# Altium project gps-barometer.PrjPcb
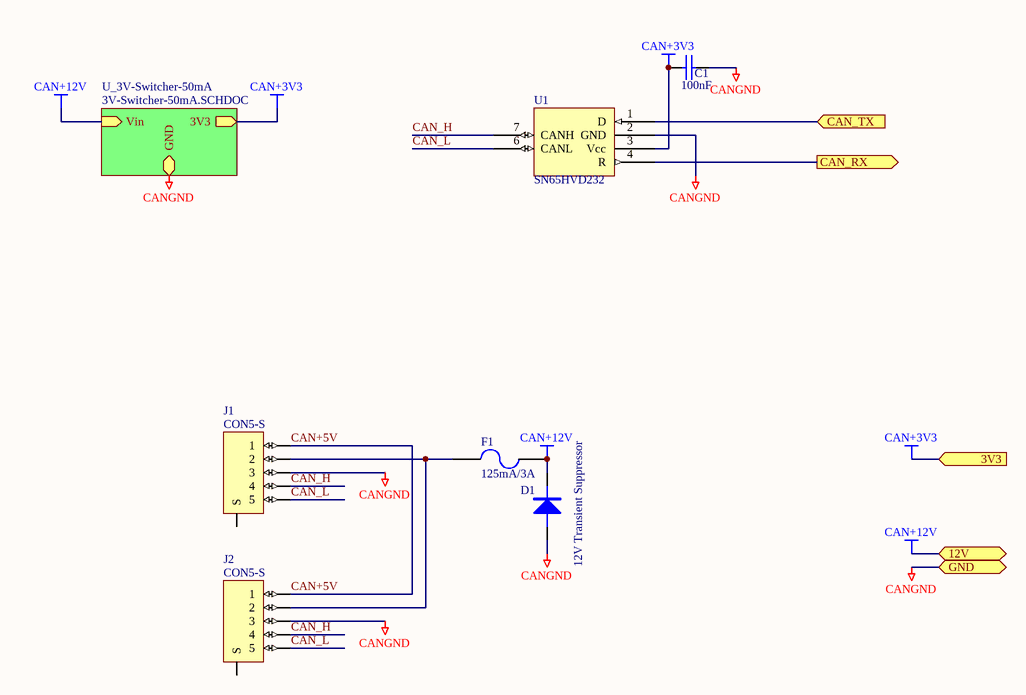
[diagram p0: 3V3-CAN-UNISOLATED.SchDoc]
4 sheets, 48 parts. Net scope: hierarchical (ports join the sheet entries above them; power ports are global).
Board files: CAN_faceplate.PcbDoc, CANFaceplate.PcbDoc, GPSBarometer.PcbDoc
Sheets:
  3V3-CAN-UNISOLATED.SchDoc
  TopLevel.SchDoc
    LPC = LPC_Rep.SchDoc
    GPSBarometer = GPSBarometer.SchDoc

## Sheet 3V3-CAN-UNISOLATED.SchDoc
size A4; Organization: UNSW Solar Racing Team; Address3: UNSW; Address4: Sydney NSW 2052; Address2: Electrical Engineering; Address1: Rm 109

### Parts
C1  100nF  [0603]
D1  12V Transient Suppressor  [SMA]
F1  125mA/3A  [LITTELFUSE-154]
J1  CON5-S  [TRIAD5F]
J2  CON5-S  [TRIAD5F]
U1  SN65HVD232  [SO8]

### Sub-sheets
U_3V-Switcher-50mA = 3V-Switcher-50mA.SCHDOC (file not in this document): GND, 3V3, Vin

### Ports
3V3, 12V, CAN_RX (out), CAN_TX (in), GND

### Nets
CAN+3V3: C1.2 U1.3(Vcc) ; port 3V3, sheet U_3V-Switcher-50mA/3V3
CAN+12V: D1.K F1.2 ; port 12V, sheet U_3V-Switcher-50mA/Vin
CANGND: C1.1 D1.A J1.3 J2.3 U1.2(GND) ; port GND, sheet U_3V-Switcher-50mA/GND
CAN+5V: J1.1 J2.1
CAN_H: J1.4 J2.4 U1.7(CANH)
CAN_L: J1.5 J2.5 U1.6(CANL)
NetF1_1: F1.1 J1.2 J2.2
NetU1_1: U1.1(D) ; port CAN_TX
NetU1_4: U1.4(R) ; port CAN_RX

Not connected (* = marked no-connect by the designer): J1 0(S); J2 0(S)

### Notes on the sheet
- Title
- Size:
- Date:
- A4
- Number:
- Time:
- Revision:
- Sheet
- of
- File:

### Library data of the parts
C1 = CAP: Capacitor; Needed?: NO - HW LAB; Value: 100nF
D1 = DIODE: Needed?: NO - Workshop; Farnell: 302-3096; Farnell Price: 1.25
F1 = FUSE2: Fuse; Needed?: NO - Workshop; Farnell: 664-893; Other Info: www.littelfuse.com; Farnell Price: 5.67
J1 J2 = CON5-S: Connector, 2 pin, with shield @ S; Needed?: NO - Workshop; Farnell Price: 19.32
U1 = SN65HVD232: 3.3V CAN Transciever; Needed?: Unsure - RS; RS: 461-9771; RS Price: 3.81; Farnell: 1103107; Farnell Price: 5.10

## Sheet TopLevel.SchDoc
size A
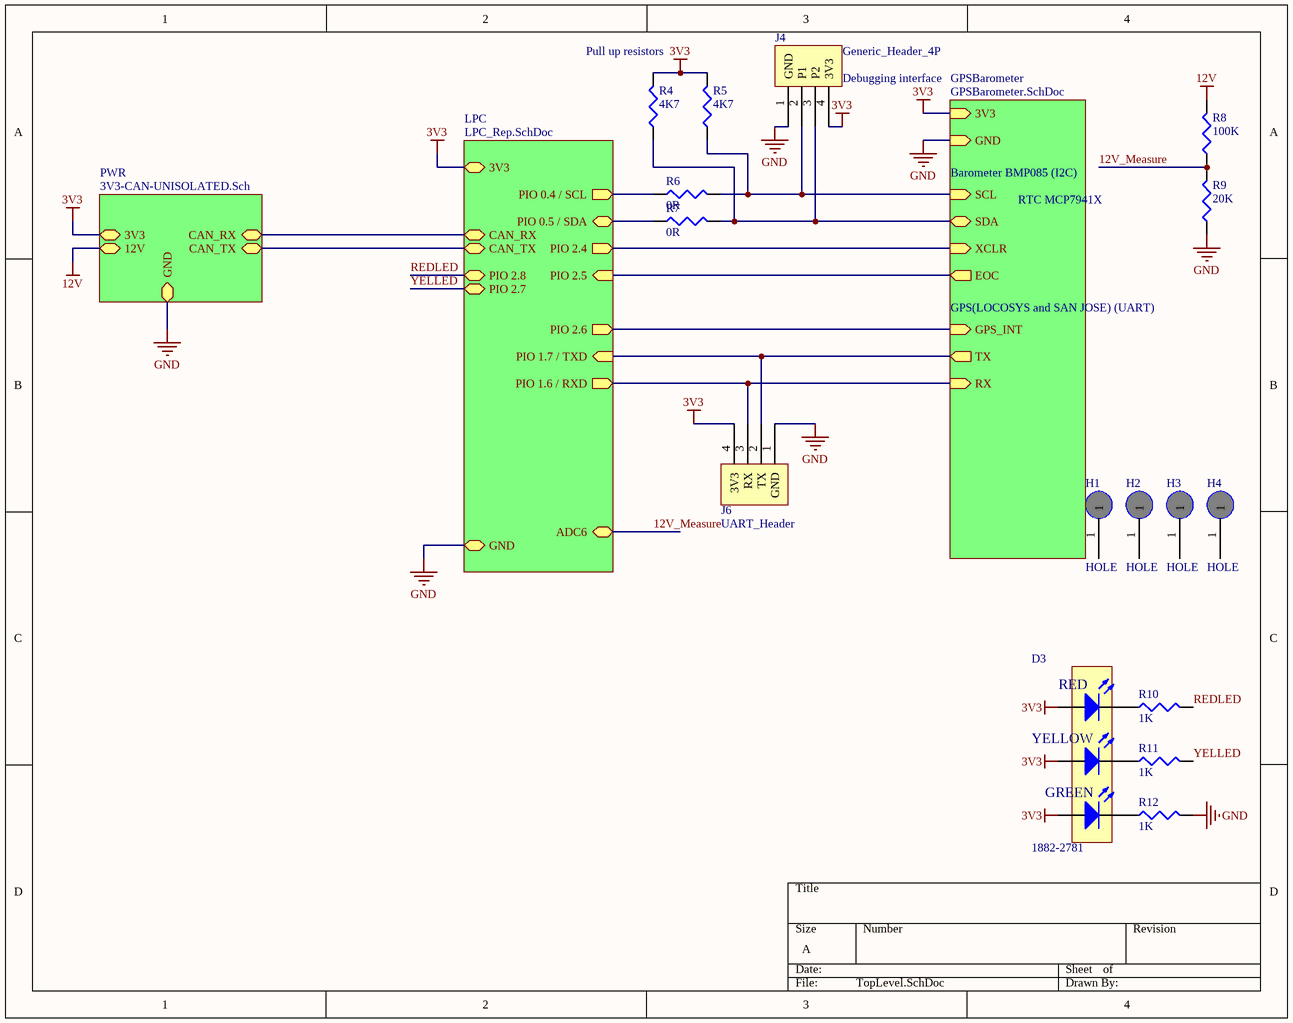
[diagram p1: TopLevel.SchDoc]

### Parts
D3  1882-2781  [LED_TRILEVEL]
H1  HOLE  [M2.5]
H2  HOLE  [M2.5]
H3  HOLE  [M2.5]
H4  HOLE  [M2.5]
J4  Generic_Header_4P  [IDC4]
J6  UART_Header  [IDC4]
R4  4K7  [0603]
R5  4K7  [0603]
R6  0R  [0603]
R7  0R  [0603]
R8  100K  [0603]
R9  20K  [0603]
R10  1K  [0603]
R11  1K  [0603]
R12  1K  [0603]

### Sub-sheets
GPSBarometer = GPSBarometer.SchDoc: 3V3 (in), RX (in), TX (out), SDA (bidir), SCL (in), XCLR (in), EOC (out), GPS_INT (in), GND (in)
LPC = LPC_Rep.SchDoc: PIO 0.4 / SCL (out), PIO 0.5 / SDA (bidir), 3V3 (bidir), CAN_RX (bidir), CAN_TX (bidir), PIO 1.6 / RXD (out), PIO 1.7 / TXD (in), ADC6 (bidir), PIO 2.5 (in), PIO 2.4 (out), PIO 2.8 (bidir), PIO 2.7 (bidir), PIO 2.6 (out), GND
PWR = 3V3-CAN-UNISOLATED.Sch (file not in this document): CAN_RX (bidir), CAN_TX (bidir), 3V3 (bidir), 12V (bidir), GND (bidir)

### Nets
3V3: D3.4(A) D3.5(A) D3.6(A) J4.4(3V3) J6.4(3V3) R4.2 R5.2 ; sheet LPC/3V3, sheet PWR/3V3, sheet GPSBarometer/3V3
12V: R8.2 ; sheet PWR/12V
GND: J4.1(GND) J6.1(GND) R9.1 R12.2 ; sheet LPC/GND, sheet PWR/GND, sheet GPSBarometer/GND
12V_Measure: R8.1 R9.2 ; sheet LPC/ADC6
I2C_SCL: J4.2(P1) R5.1 R6.2 ; sheet GPSBarometer/SCL
I2C_SDA: J4.3(P2) R4.1 R7.2 ; sheet GPSBarometer/SDA
REDLED: R10.2 ; sheet LPC/PIO 2.8
YELLED: R11.2 ; sheet LPC/PIO 2.7
NetBarometer_BMP_085_EOC: sheet LPC/PIO 2.5, sheet GPSBarometer/EOC
NetBarometer_BMP_085_XCLR: sheet LPC/PIO 2.4, sheet GPSBarometer/XCLR
NetD3_1: D3.1(K) R12.1
NetD3_2: D3.2(K) R11.1
NetD3_3: D3.3(K) R10.1
NetGPS_PPS: sheet LPC/PIO 2.6, sheet GPSBarometer/GPS_INT
NetGPS_RX: J6.3(RX) ; sheet LPC/PIO 1.6 / RXD, sheet GPSBarometer/RX
NetGPS_TX: J6.2(TX) ; sheet LPC/PIO 1.7 / TXD, sheet GPSBarometer/TX
NetR6_1: R6.1 ; sheet LPC/PIO 0.4 / SCL
NetR7_1: R7.1 ; sheet LPC/PIO 0.5 / SDA
NetU7_19: sheet LPC/CAN_RX, sheet PWR/CAN_RX
NetU7_20: sheet LPC/CAN_TX, sheet PWR/CAN_TX

Not connected (* = marked no-connect by the designer): H1 1; H2 1; H3 1; H4 1

### Notes on the sheet
- Pull up resistors
- (near J4) Debugging interface
- Barometer BMP085 (I2C)
- RTC MCP7941X
- GPS(LOCOSYS and SAN JOSE) (UART)
- (in symbol LED-TRILEVEL) RED; YELLOW; GREEN

### Library data of the parts
D3 = LED-TRILEVEL: Three level LED; Needed?: Farnell - Low Stock; Farnell: 1461596; Farnell Price: 4.56
H1-H4 = HOLE: Needed?: NO - Footprint
J4 = Generic_Header_4P: Needed?: NO - Common
J6 = UART_Header: Needed?: NO - Common
R4 R5 = RES1: Resistor; Value: 4.7k; Needed?: NO - HW LAB
R6-R12 = RES1: Resistor; Needed?: NO - HW LAB
  R6 R7: Value: 0R
  R8: Value: 100k
  R9: Value: 20k
  R10-R12: Value: 1k

## Sheet LPC_Rep.SchDoc
size A4; Organization: UNSW Solar Racing Team; Address3: UNSW; Address4: Sydney NSW 2052; Address2: Electrical Engineering; Address1: Rm 109
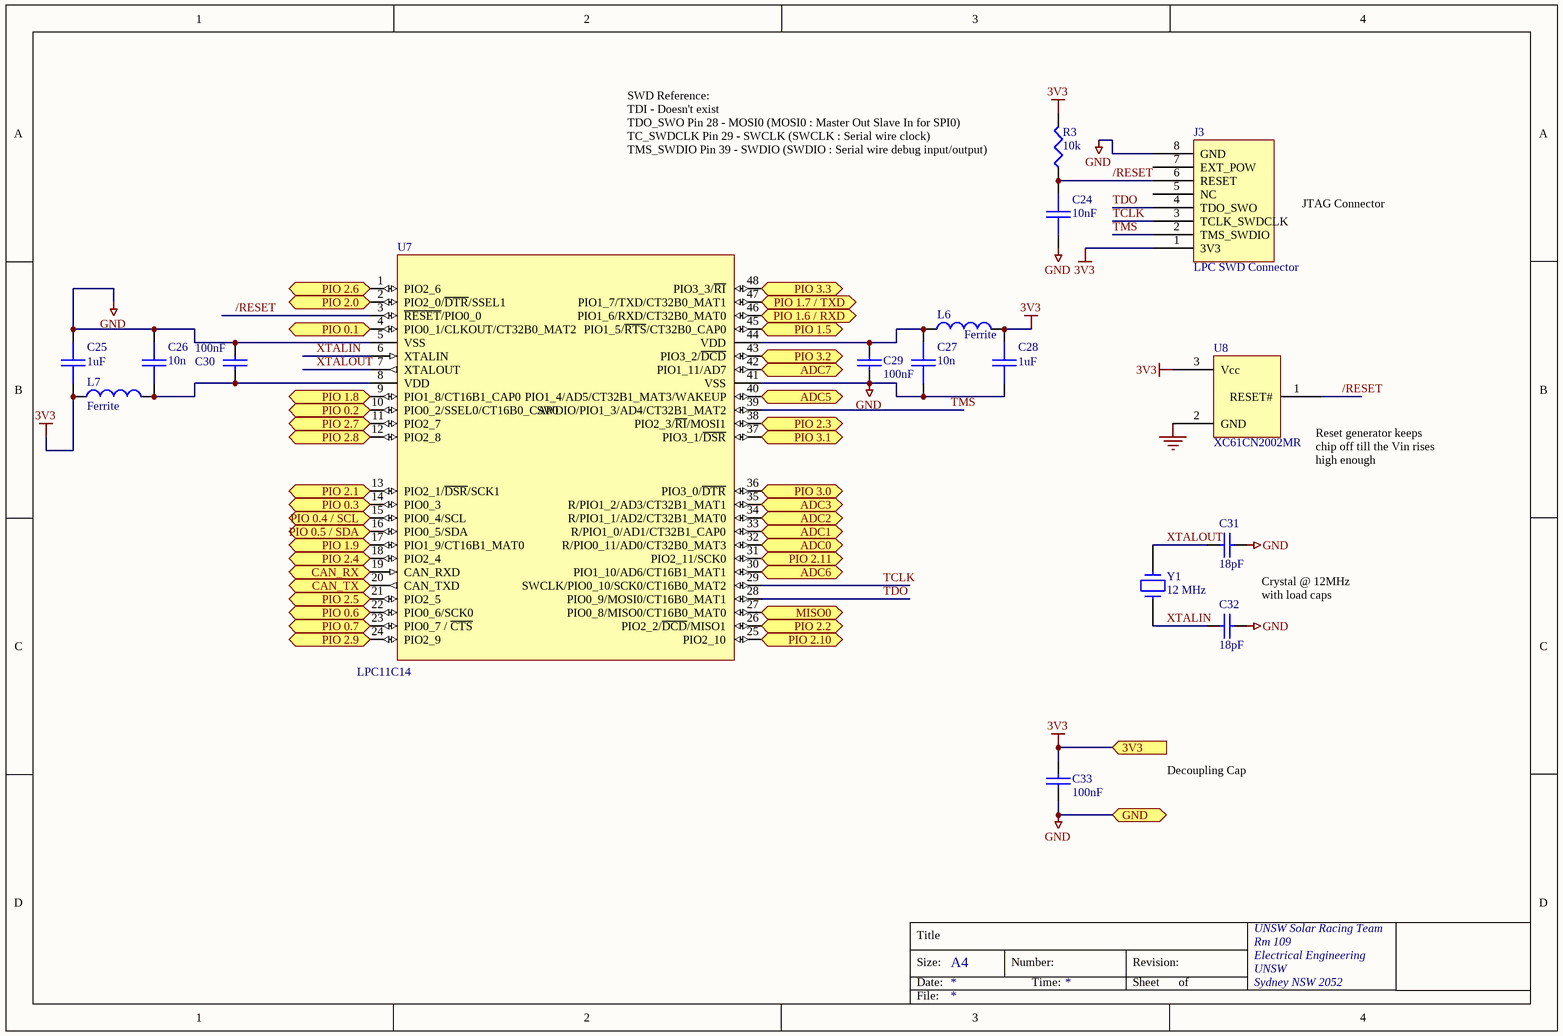
[diagram p2: LPC_Rep.SchDoc]

### Parts
C24  10nF  [0603]
C25  value 1uF  [0603]  (hidden comment: 1u)
C26  10n  [0603]
C27  10n  [0603]
C28  value 1uF  [0603]  (hidden comment: 1u)
C29  100nF  [0603]
C30  100nF  [0603]
C31  18pF  [0603]
C32  18pF  [0603]
C33  100nF  [0603]
J3  LPC SWD Connector  [IDC8]
L6  Ferrite  [0603]
L7  Ferrite  [0603]
R3  10k  [0603]
U7  LPC11C14  [TSQFP50P900X900-48N]
U8  XC61CN2002MR  [SOT23(3)]
Y1  12 MHz  [HC49/4H]

### Ports
3V3, ADC0 (in), ADC1 (in), ADC2 (in), ADC3 (in), ADC5 (in), ADC6 (in), ADC7 (in), CAN_RX (in), CAN_TX (out), GND, MISO0, PIO 0.1 (bidir), PIO 0.2 (bidir), PIO 0.3 (bidir), PIO 0.4 / SCL (bidir), PIO 0.5 / SDA (bidir), PIO 0.6 (bidir), PIO 0.7 (bidir), PIO 1.5 (bidir), PIO 1.6 / RXD (bidir), PIO 1.7 / TXD (bidir), PIO 1.8 (bidir), PIO 1.9 (bidir), PIO 2.0 (bidir), PIO 2.1 (bidir), PIO 2.2 (bidir), PIO 2.3 (bidir), PIO 2.4 (bidir), PIO 2.5 (bidir), PIO 2.6 (bidir), PIO 2.7 (bidir), PIO 2.8 (bidir), PIO 2.9 (bidir), PIO 2.10 (bidir), PIO 2.11 (bidir), PIO 3.0 (bidir), PIO 3.1 (bidir), PIO 3.2 (bidir), PIO 3.3 (bidir)

### Nets
3V3: C25.2 C28.1 C33.1 J3.1(3V3) L6.2 L7.1 R3.2 U8.3(Vcc) ; port 3V3
GND: C24.2 C25.1 C26.1 C27.2 C28.2 C29.2 C30.1 C31.2 C32.2 C33.2 J3.8(GND) U7.5(VSS) U7.41(VSS) U8.2(GND) ; port GND
12V_Measure: U7.30(PIO1_10/AD6/CT16B1_MAT1) ; port ADC6
/RESET: C24.1 J3.6(RESET) R3.1 U7.3(~{RESET}/PIO0_0) U8.1(RESET#)
REDLED: U7.12(PIO2_8) ; port PIO 2.8
TCLK: J3.3(TCLK_SWDCLK) U7.29(SWCLK/PIO0_10/SCK0/CT16B0_MAT2)
TDO: J3.4(TDO_SWO) U7.28(PIO0_9/MOSI0/CT16B0_MAT1)
TMS: J3.2(TMS_SWDIO) U7.39(SWDIO/PIO1_3/AD4/CT32B1_MAT2)
XTALIN: C32.1 U7.6(XTALIN) Y1.1
XTALOUT: C31.1 U7.7(XTALOUT) Y1.2
YELLED: U7.11(PIO2_7) ; port PIO 2.7
NetBarometer_BMP_085_EOC: U7.21(PIO2_5) ; port PIO 2.5
NetBarometer_BMP_085_XCLR: U7.18(PIO2_4) ; port PIO 2.4
NetC26_2: C26.2 C30.2 L7.2 U7.8(VDD)
NetC27_1: C27.1 C29.1 L6.1 U7.44(VDD)
NetGPS_PPS: U7.1(PIO2_6) ; port PIO 2.6
NetGPS_RX: U7.46(PIO1_6/RXD/CT32B0_MAT0) ; port PIO 1.6 / RXD
NetGPS_TX: U7.47(PIO1_7/TXD/CT32B0_MAT1) ; port PIO 1.7 / TXD
NetR6_1: U7.15(PIO0_4/SCL) ; port PIO 0.4 / SCL
NetR7_1: U7.16(PIO0_5/SDA) ; port PIO 0.5 / SDA
NetU7_2: U7.2(PIO2_0/~{DTR}/SSEL1) ; port PIO 2.0
NetU7_4: U7.4(PIO0_1/CLKOUT/CT32B0_MAT2) ; port PIO 0.1
NetU7_9: U7.9(PIO1_8/CT16B1_CAP0) ; port PIO 1.8
NetU7_10: U7.10(PIO0_2/SSEL0/CT16B0_CAP0) ; port PIO 0.2
NetU7_13: U7.13(PIO2_1/~{DSR}/SCK1) ; port PIO 2.1
NetU7_14: U7.14(PIO0_3) ; port PIO 0.3
NetU7_17: U7.17(PIO1_9/CT16B1_MAT0) ; port PIO 1.9
NetU7_19: U7.19(CAN_RXD) ; port CAN_RX
NetU7_20: U7.20(CAN_TXD) ; port CAN_TX
NetU7_22: U7.22(PIO0_6/SCK0) ; port PIO 0.6
NetU7_23: U7.23(PIO0_7_/_~{CTS}) ; port PIO 0.7
NetU7_24: U7.24(PIO2_9) ; port PIO 2.9
NetU7_25: U7.25(PIO2_10) ; port PIO 2.10
NetU7_26: U7.26(PIO2_2/~{DCD}/MISO1) ; port PIO 2.2
NetU7_27: U7.27(PIO0_8/MISO0/CT16B0_MAT0) ; port MISO0
NetU7_31: U7.31(PIO2_11/SCK0) ; port PIO 2.11
NetU7_32: U7.32(R/PIO0_11/AD0/CT32B0_MAT3) ; port ADC0
NetU7_33: U7.33(R/PIO1_0/AD1/CT32B1_CAP0) ; port ADC1
NetU7_34: U7.34(R/PIO1_1/AD2/CT32B1_MAT0) ; port ADC2
NetU7_35: U7.35(R/PIO1_2/AD3/CT32B1_MAT1) ; port ADC3
NetU7_36: U7.36(PIO3_0/~{DTR}) ; port PIO 3.0
NetU7_37: U7.37(PIO3_1/~{DSR}) ; port PIO 3.1
NetU7_38: U7.38(PIO2_3/~{RI}/MOSI1) ; port PIO 2.3
NetU7_40: U7.40(PIO1_4/AD5/CT32B1_MAT3/WAKEUP) ; port ADC5
NetU7_42: U7.42(PIO1_11/AD7) ; port ADC7
NetU7_43: U7.43(PIO3_2/~{DCD}) ; port PIO 3.2
NetU7_45: U7.45(PIO1_5/~{RTS}/CT32B0_CAP0) ; port PIO 1.5
NetU7_48: U7.48(PIO3_3/~{RI}) ; port PIO 3.3

Not connected (* = marked no-connect by the designer): J3 5(NC) 7(EXT_POW)

### Notes on the sheet
- SWD Reference:
  TDI - Doesn't exist
  TDO_SWO Pin 28 - MOSI0 (MOSI0 : Master Out Slave In for SPI0)
  TC_SWDCLK Pin 29 - SWCLK (SWCLK : Serial wire clock)
  TMS_SWDIO Pin 39 - SWDIO (SWDIO : Serial wire debug input/output)
- JTAG Connector
- (near U8) Reset generator keeps chip off till the Vin rises high enough
- Crystal @ 12MHz with load caps
- Decoupling Cap
- Title
- Size:
- Date:
- A4
- Number:
- Time:
- Revision:
- Sheet
- of
- File:

### Library data of the parts
C24 C29 C30 C33 = CAP: Capacitor; Needed?: NO - HW LAB
  C24: Value: 10nF
  C29 C30 C33: Value: 100nF
C25 C28 = CAP: Capacitor; Needed?: RS; RS: 640-6404; RS Price: 0.06
C26 C27 = CAP: Capacitor; Value: 1nF; Needed?: NO - HW LAB; Revision: July-2002: Re-released for DXP Platform.
C31 C32 = CAP: Capacitor; Needed?: Farnell; Value: 18pF; Farnell: 1844169; Farnell Price: 0.025
J3 = LPCLink_Connector: Needed?: NO - Common
L6 L7 = INDUCTOR: Manufacturer: Generic Components; Needed?: Farnell; Published: 8-Jun-2000; Revision: July-2002: Re-released for DXP Platform.; Publisher: Altium Limited; Farnell: 1839565; Farnell Price: 0.65
R3 = RES1: Resistor; Needed?: NO - HW LAB; Value: 10k
U7 = LPC11C14_Full: Needed?: Farnell; Farnell: 1812185; Farnell Price: 8.38
U8 = XC61F: SOT23 reset generator; Needed?: Farnell; Farnell: 3605486; Farnell Price: 1.74
Y1 = CRYSTAL: Needed?: RS; RS: 693-8803; RS Price: 0.95

## Sheet GPSBarometer.SchDoc
size A4
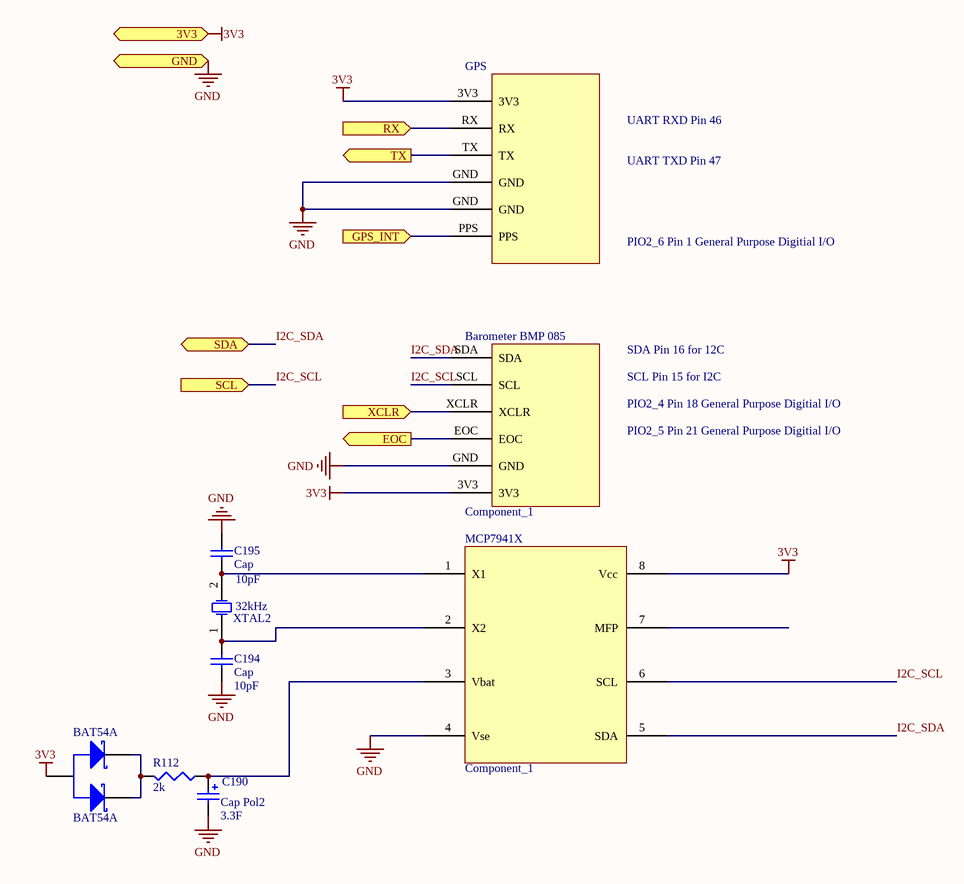
[diagram p3: GPSBarometer.SchDoc]

### Parts
32kHz  XTAL2  [WATCHA]
Barometer_BMP_085  Component_1  [PCBComponent_1]
BAT54A  BAT54A  [SOT23_2]
C190  Cap Pol2  value 3.3F  [SUPERCAP]
C194  Cap  C194: 10pF  [0603]
C195  Cap  value 10pF  [0603]
GPS  GPS  [GPS]  (value not drawn)
MCP7941X  Component_1  [SO8]
R112  2k  [0603]

### Ports
3V3 (in), EOC (out), GND (in), GPS_INT (in), RX (in), SCL (in), SDA (bidir), TX (out), XCLR (in)

### Nets
3V3: Barometer_BMP_085.3V3 BAT54A.3 GPS.3V3 MCP7941X.8(Vcc) ; port 3V3
GND: Barometer_BMP_085.GND C190.2 C194.1 C195.1 GPS.GND MCP7941X.4(Vse) ; port GND
I2C_SCL: Barometer_BMP_085.SCL MCP7941X.6(SCL) ; port SCL
I2C_SDA: Barometer_BMP_085.SDA MCP7941X.5(SDA) ; port SDA
Net32kHz_1: 32kHz.1(OSC1) C194.2 MCP7941X.2(X2)
Net32kHz_2: 32kHz.2(OSC2) C195.2 MCP7941X.1(X1)
NetBarometer_BMP_085_EOC: Barometer_BMP_085.EOC ; port EOC
NetBarometer_BMP_085_XCLR: Barometer_BMP_085.XCLR ; port XCLR
NetBAT54A_1: BAT54A.1 BAT54A.2 R112.2
NetC190_1: C190.1 MCP7941X.3(Vbat) R112.1
NetGPS_PPS: GPS.PPS ; port GPS_INT
NetGPS_RX: GPS.RX ; port RX
NetGPS_TX: GPS.TX ; port TX

Not connected (* = marked no-connect by the designer): MCP7941X 7(MFP)

### Notes on the sheet
- UART RXD Pin 46
- UART TXD Pin 47
- PIO2_6 Pin 1 General Purpose Digitial I/O
- SDA Pin 16 for 12C
- SCL Pin 15 for I2C
- PIO2_4 Pin 18 General Purpose Digitial I/O
- PIO2_5 Pin 21 General Purpose Digitial I/O

### Library data of the parts
32kHz = XTAL: Crystal Oscillator; Published: 8-Jun-2000; LatestRevisionDate: 17-Jul-2002; LatestRevisionNote: Re-released for DXP Platform.; PackageReference: R38; Publisher: Altium Limited
Barometer_BMP_085 = Component_1: Name: Barometric Pressure Sensor - BMP085 Breakout; Website: http://www.sparkfun.com/products/9694; Price: $19.95
BAT54A = BAT54A: Name: DIODE SCHTTKY CA 200MA 30V SOT23; Price: $0.85; Digikey: 641-1319-1-ND
C190 = Cap Pol2: Polarized Capacitor (Axial); Published: 8-Jun-2000; LatestRevisionDate: 17-Jul-2002; LatestRevisionNote: Re-released for DXP Platform.; PackageReference: POLAR0.8; Publisher: Altium Limited
C194 C195 = Cap: Capacitor; Published: 8-Jun-2000; LatestRevisionDate: 17-Jul-2002; LatestRevisionNote: Re-released for DXP Platform.; PackageReference: RAD-0.3; Publisher: Altium Limited
GPS = GPS: Name: 66 Channel LS20031 GPS 10Hz Receiver; Sparkfun: GPS-08975; Price: $59.95
MCP7941X = Component_1: Name: MCP79410 Real-Time Clock Chips; Digikey: MCP79410-I/SN-ND; Price: $1.31; Website: http://search.digikey.com/scripts/DkSearch/dksus.dll?Detail&name=MCP79410-I/SN-ND
R112 = RES1: Resistor; Value: 20k; Needed?: NO - HW LAB

## Nets that join several sheets
3V3: TopLevel (7 pins), LPC_Rep (8 pins), GPSBarometer (Barometer_BMP_085.3V3 BAT54A.3 GPS.3V3 MCP7941X.8)
GND: TopLevel (J4.1 J6.1 R9.1 R12.2), LPC_Rep (14 pins), GPSBarometer (6 pins)
12V_Measure: TopLevel (R8.1 R9.2), LPC_Rep (U7.30)
I2C_SCL: TopLevel (J4.2 R5.1 R6.2), GPSBarometer (Barometer_BMP_085.SCL MCP7941X.6)
I2C_SDA: TopLevel (J4.3 R4.1 R7.2), GPSBarometer (Barometer_BMP_085.SDA MCP7941X.5)
NetBarometer_BMP_085_EOC: LPC_Rep (U7.21), GPSBarometer (Barometer_BMP_085.EOC)
NetBarometer_BMP_085_XCLR: LPC_Rep (U7.18), GPSBarometer (Barometer_BMP_085.XCLR)
NetGPS_PPS: LPC_Rep (U7.1), GPSBarometer (GPS.PPS)
NetGPS_RX: TopLevel (J6.3), LPC_Rep (U7.46), GPSBarometer (GPS.RX)
NetGPS_TX: TopLevel (J6.2), LPC_Rep (U7.47), GPSBarometer (GPS.TX)
NetR6_1: TopLevel (R6.1), LPC_Rep (U7.15)
NetR7_1: TopLevel (R7.1), LPC_Rep (U7.16)
REDLED: TopLevel (R10.2), LPC_Rep (U7.12)
YELLED: TopLevel (R11.2), LPC_Rep (U7.11)